# Altium schematic sheet USB_FT232_UART.SchDoc
size A4; SheetNumber: 5; SheetTotal: 7
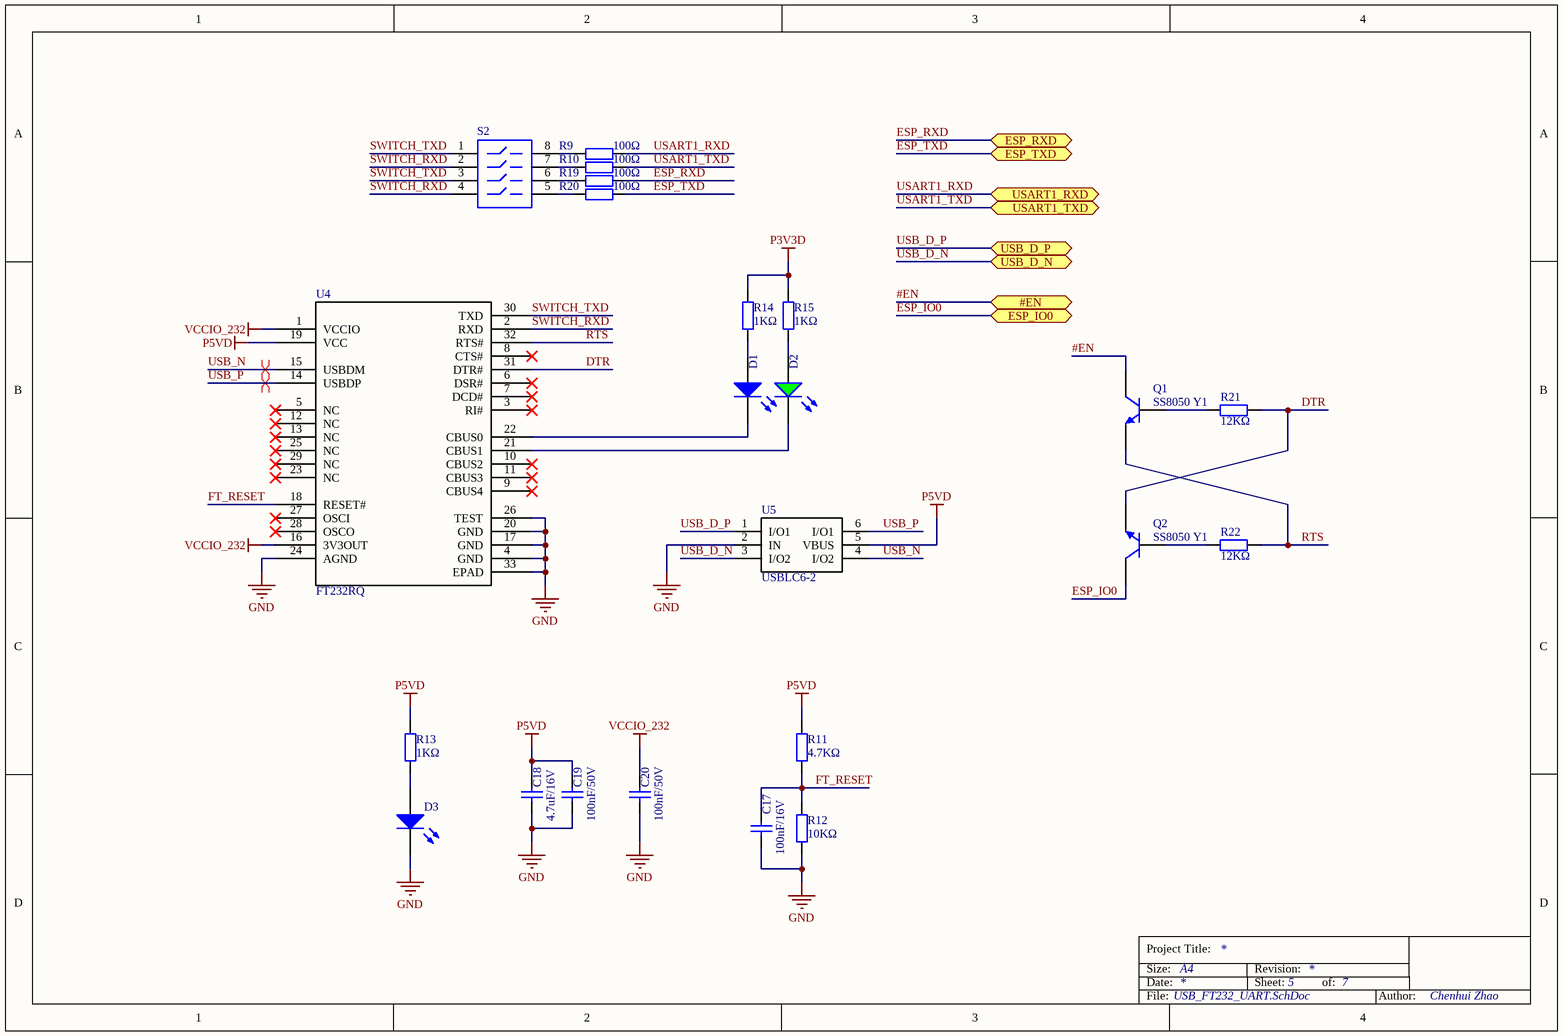
[diagram p0: USB_FT232_UART.SchDoc]

## Parts
C17  100nF/16V  [0402_C]
C18  4.7uF/16V  [0603_C]
C19  100nF/50V  [0603_C]
C20  100nF/50V  [0603_C]
D1  蓝灯 0603  [0603_LED_S1]  (value not drawn)
D2  绿灯 0603  [0603_LED_S1]  (value not drawn)
D3  蓝灯 0603  [0603_LED_S1]  (value not drawn)
Q1  SS8050 Y1  [SOT-23(SOT-23-3)]
Q2  SS8050 Y1  [SOT-23(SOT-23-3)]
R9  100Ω  [0402_R]
R10  100Ω  [0402_R]
R11  4.7KΩ  [0402_R]
R12  10KΩ  [0402_R]
R13  1KΩ  [0402_R]
R14  1KΩ  [0402_R]
R15  1KΩ  [0402_R]
R19  100Ω  [0402_R]
R20  100Ω  [0402_R]
R21  12KΩ  [0402_R]
R22  12KΩ  [0402_R]
S2  拨码开关  [SW_SMT8]  (value not drawn)
U4  FT232RQ  [QFN-32]
U5  USBLC6-2  [SOT23-6]

## Ports
#EN (bidir), ESP_IO0 (bidir), ESP_RXD (bidir), ESP_TXD (bidir), USART1_RXD (bidir), USART1_TXD (bidir), USB_D_N (bidir), USB_D_P (bidir)

## Nets
GND: C17.1 C18.1 C19.1 C20.1 D3.K R12.1 U4.4(GND) U4.17(GND) U4.20(GND) U4.24(AGND) U4.26(TEST) U4.33(EPAD) U5.2(IN)
P3V3D: R14.2 R15.2
P5VD: C18.2 C19.2 R11.2 R13.2 U4.19(VCC) U5.5(VBUS)
VCCIO_232: C20.2 U4.1(VCCIO) U4.16(3V3OUT)
#EN: Q1.3(C) ; port #EN
DTR: Q2.2(E) R21.2 U4.31(DTR#)
ESP_IO0: Q2.3(C) ; port ESP_IO0
ESP_RXD: R19.2 ; port ESP_RXD
ESP_TXD: R20.2 ; port ESP_TXD
FT_RESET: C17.2 R11.1 R12.2 U4.18(RESET#)
RTS: Q1.2(E) R22.2 U4.32(RTS#)
SWITCH_RXD: S2.2 S2.4 U4.2(RXD)
SWITCH_TXD: S2.1 S2.3 U4.30(TXD)
USART1_RXD: R9.2 ; port USART1_RXD
USART1_TXD: R10.2 ; port USART1_TXD
USB_D_N: U5.3(I/O2) ; port USB_D_N
USB_D_P: U5.1(I/O1) ; port USB_D_P
USB_N: U4.15(USBDM) U5.4(I/O2)
USB_P: U4.14(USBDP) U5.6(I/O1)
NetD1_A: D1.A R14.1
NetD1_K: D1.K U4.22(CBUS0)
NetD2_A: D2.A R15.1
NetD2_K: D2.K U4.21(CBUS1)
NetD3_A: D3.A R13.1
NetQ1_1: Q1.1(B) R21.1
NetQ2_1: Q2.1(B) R22.1
NetR9_1: R9.1 S2.8
NetR10_1: R10.1 S2.7
NetR19_1: R19.1 S2.6
NetR20_1: R20.1 S2.5

Not connected (* = marked no-connect by the designer): U4 3(RI#)* 5(NC)* 6(DSR#)* 7(DCD#)* 8(CTS#)* 9(CBUS4)* 10(CBUS2)* 11(CBUS3)* 12(NC)* 13(NC)* 23(NC)* 25(NC)* 27(OSCI)* 28(OSCO)* 29(NC)*

## Layout directives
differential pair: USB_N, USB_P

## Notes on the sheet
- Date:
- Size:
- Project Title:
- A4
- Revision:
- Sheet:
- of:
- File:
- Author:
- Chenhui Zhao

## Library data of the parts
C17 = 0402 100nF (104) 10% 16V: 贴片电容; ComponentLink1Description: 供应商链接; ComponentLink1URL: http://www.szlcsc.com/product/details_1877.html; Package: 0402; Supplier: LC; SuppliersPartNumber: C1525
C18 = 0603 4.7uF (475) 10% 16V: 贴片电容; ComponentLink1Description: 供应商链接; ComponentLink1URL: http://www.szlcsc.com/product/details_20375.html; Package: 0603; Supplier: LC; SuppliersPartNumber: C19666
C19 C20 = 0603 100nF (104) 10% 50V: 贴片电容; ComponentLink1Description: 供应商链接; ComponentLink1URL: http://www.szlcsc.com/product/details_15331.html; Package: 0603; Supplier: LC; SuppliersPartNumber: C14663
D1 D3 = 0603 蓝灯: 发光二极管; ComponentLink1Description: 供应商链接; ComponentLink1URL: http://www.szlcsc.com/product/details_73150.html; Package: 0603; Supplier: LC; SuppliersPartNumber: C72041
D2 = 0603 绿灯: 发光二极管; ComponentLink1Description: 供应商链接; ComponentLink1URL: http://www.szlcsc.com/product/details_73152.html; Package: 0603; Supplier: LC; SuppliersPartNumber: C72043
Q1 Q2 = SOT-23 SS8050 Y1: 三极管; ComponentLink1Description: 供应商链接; ComponentLink1URL: http://www.szlcsc.com/product/details_2507.html; Package: SOT-23; Supplier: LC; SuppliersPartNumber: C2150
R9 R10 R19 R20 = 0402 100Ω (1000) 1%: 贴片电阻; ComponentLink1Description: 供应商链接; ComponentLink1URL: http://www.szlcsc.com/product/details_25819.html; Package: 0402; Supplier: LC; SuppliersPartNumber: C25076
R11 = 0402 4.7KΩ (4701) 1%: 贴片电阻; ComponentLink1Description: 供应商链接; ComponentLink1URL: http://www.szlcsc.com/product/details_26643.html; Package: 0402; Supplier: LC; SuppliersPartNumber: C25900
R12 = 0402 10KΩ (1002) 1%: 贴片电阻; ComponentLink1Description: 供应商链接; ComponentLink1URL: http://www.szlcsc.com/product/details_26487.html; Package: 0402; Supplier: LC; SuppliersPartNumber: C25744
R13-R15 = 0402 1KΩ (1001) 1%: 贴片电阻; ComponentLink1Description: 供应商链接; ComponentLink1URL: http://www.szlcsc.com/product/details_12256.html; Package: 0402; Supplier: LC; SuppliersPartNumber: C11702
R21 R22 = 0402 12KΩ (1202) 1%: 贴片电阻; ComponentLink1Description: 供应商链接; ComponentLink1URL: http://www.szlcsc.com/product/details_26495.html; Package: 0402; Supplier: LC; SuppliersPartNumber: C25752
S2 = SW-SMT4: SMT Switch, 4 Position, SPST
U4 = FT232RQ: USB to serial UART interface
U5 = USBLC6-2: Very low capacitance ESD protection